# EAGLE design battery_watcher (EAGLE 9.3.2)
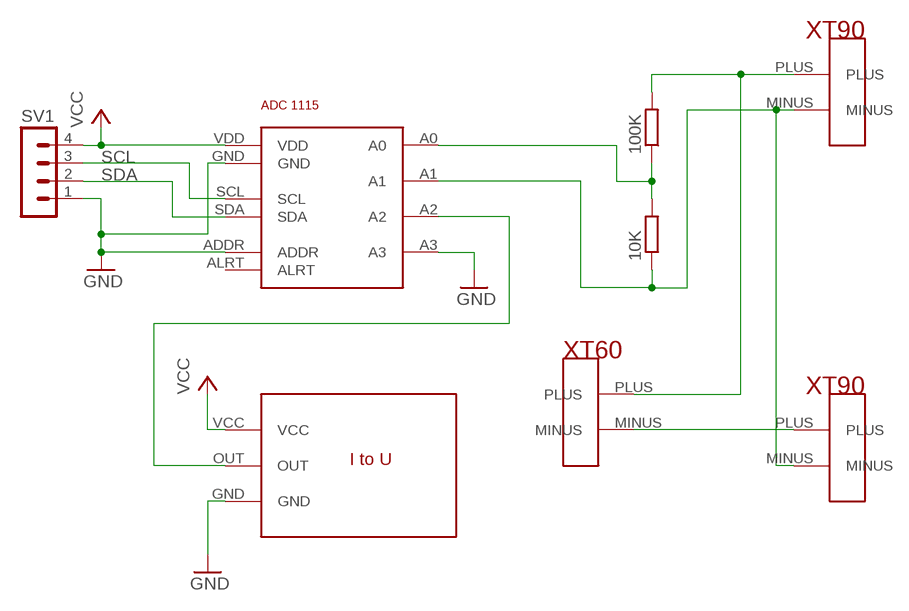
[diagram p0: schematic, sheet 1]

## Parts
10K  R-EU_M1206  [M1206]
100K  R-EU_M1206  [M1206]
SV1  MA04-1  [MA04-1]
U$1  ADC1115  [ADC1115]
U$2  I2U_MODULE  [I2U]
U$3  XT90  [XT90]
U$4  XT90  [XT90]
U$5  XT60  [XT60]

## Nets
GND: SV1.1 U$1.A3 U$1.ADDR U$1.GND U$2.GND
N$1: U$1.A2 U$2.OUT
N$2: 10K.2 100K.1 U$1.A0
N$3: 100K.2 U$4.PLUS U$5.PLUS
N$4: 10K.1 U$1.A1 U$3.MINUS U$4.MINUS
N$6: U$3.PLUS U$5.MINUS
SCL: SV1.3 U$1.SCL
SDA: SV1.2 U$1.SDA
VCC: SV1.4 U$1.VDD U$2.VCC
Unconnected: U$1.ALRT

## Library data of the parts
10K 100K = rcl:R-EU_: RESISTOR, European symbol; SPICEPREFIX: R
SV1 = con-lstb:MA04-1: PIN HEADER; OC_FARNELL: unknown; OC_NEWARK: unknown
U$1 = ligocki:ADC1115
U$2 = ligocki:I2U_MODULE
U$3 U$4 = ligocki:XT90
U$5 = ligocki:XT60

## Board
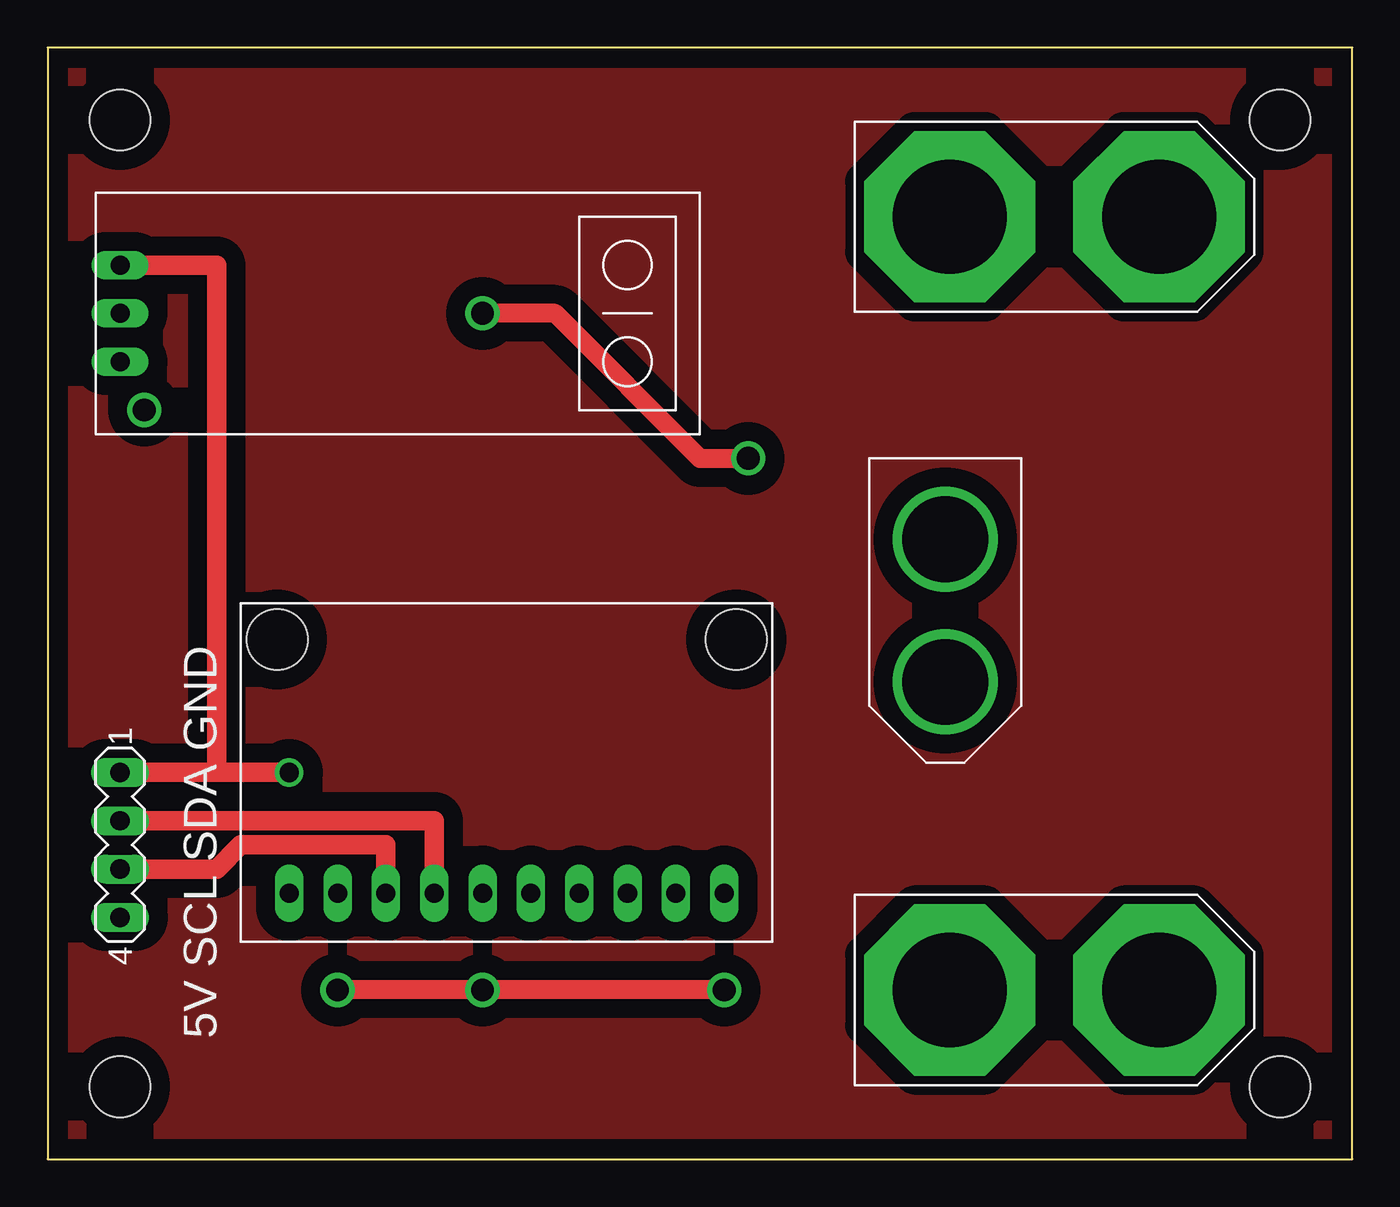
[diagram p1: board, top side]
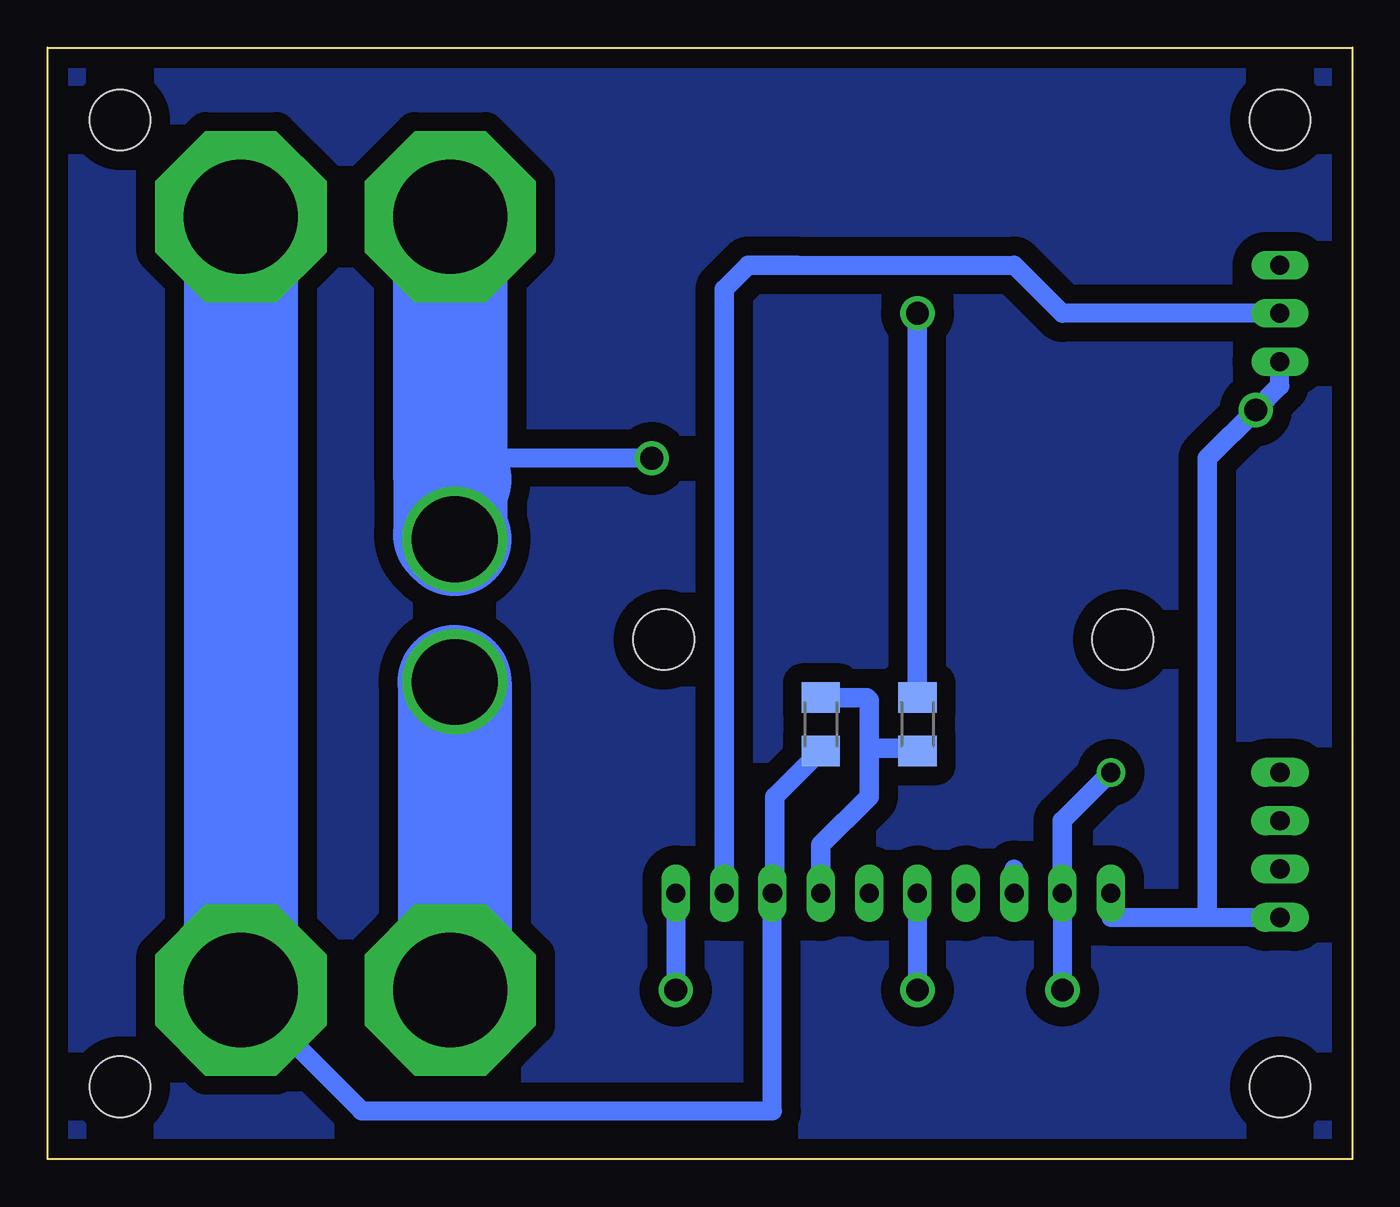
[diagram p2: board, bottom side, seen from below]

Size 68.58 x 58.42 mm. Coordinates in mm from the lower left corner, seen from the top.
Outline: 0,0 68.58,0 68.58,58.42 0,58.42 0,0
Copper layers (1*16): Top 0.035mm / dielectric 1.5mm / Bottom 0.035mm
Design rules "default": minimum track width 6mil, minimum drill 0.35mm, track to track 6mil, track to pad 6mil, pad to pad 6mil, via to via 6mil, smd to smd 6mil, copper to edge 40mil, drill to drill 6mil, minimum pad ring 10mil, minimum via ring 8mil, stop-mask expansion 4mil, vias tented up to drill 0mil, thermal gap 10mil
Holes 3.2 mm at 3.81,3.81 64.77,3.81 64.77,54.61 3.81,54.61

### Footprints (pad centres in the part's own frame; a part is rotated, then mirrored left to right if it is on the bottom)
M1206 = smd 1.6 x 2: 1 -1.4,0; 2 1.4,0
MA04-1 = drill 1.016 long: 1 -3.81,0; 2 -1.27,0; 3 1.27,0; 4 3.81,0
ADC1115 = drill 1 long: A0 17.78,2.54; A1 20.32,2.54; A2 22.86,2.54; A3 25.4,2.54; ADDR 12.7,2.54; ALRT 15.24,2.54; GND 5.08,2.54; SCL 7.62,2.54; SDA 10.16,2.54; VDD 2.54,2.54 | hole 3.2: 1.905,15.875; 26.035,15.875
I2U = drill 1 long: GND 3.81,1.27; OUT 6.35,1.27; VCC 8.89,1.27
XT90 = drill 6 pad 9 octagon: MINUS 0,0; PLUS 11,0
XT60 = drill 4.5 pad 5.5: MINUS 11.75,4; PLUS 4.25,4

### Placement (x,y rotation side)
10K  27.94,22.86 90 bottom
100K  22.86,22.86 90 bottom
SV1  3.81,16.51 270 top
U$1  10.16,11.43 0 top
U$2  2.54,50.8 270 top
U$3  58.42,8.89 180 top
U$4  58.42,49.53 180 top
U$5  43.18,36.83 270 top

### Tracks (layer width: path | path; a pad name or v marks a point on that pad's centre or on a via)
GND  (via drill 1, 1.2)
  Top 1: v35.56,8.89 v22.86,8.89 v15.24,8.89
  Top 1.016: SV1.1 8.89,20.32 | 8.89,20.32 v12.7,20.32 | U$2.GND 8.89,46.99 8.89,20.32
  Bottom 1: U$1.A3 v35.56,8.89 | U$1.GND v15.24,8.89 | U$1.ADDR v22.86,8.89
  Bottom 1.016: v12.7,20.32 15.24,17.78 U$1.GND
N$1
  Bottom 1: 29.21,46.99 17.78,46.99 15.24,44.45 U$2.OUT
  Bottom 1.016: U$1.A2 33.02,45.72 31.75,46.99 29.21,46.99
N$2
  Bottom 1.016: 100K.1 22.99,21.59 25.4,21.59 | 25.4,21.59 25.4,24.13 25.53,24.26 10K.2 | U$1.A0 27.94,16.51 25.4,19.05 25.4,21.59
N$3  (via drill 1.2)
  Top 1: v36.83,36.83 34.29,36.83 26.67,44.45 v22.86,44.45
  Bottom 1: v36.83,36.83 47.18,36.83 47.18,35.73
  Bottom 1.016: 100K.2 v22.86,44.45
  Bottom 6: 47.18,35.73 47.42,35.97 U$4.PLUS 47.42,32.82 U$5.PLUS
N$4
  Bottom 1: U$3.MINUS 52.07,2.54 30.48,2.54 U$1.A1 30.35,13.97
  Bottom 1.016: 10K.1 30.35,19.05 30.35,13.97
  Bottom 6: U$4.MINUS U$3.MINUS
N$5
  pour Top (isolate 1): 0,58.42 68.58,58.42 68.58,0 0,0
N$6
  Bottom 6: U$5.MINUS 47.18,9.13 U$3.PLUS
N$7
  pour Bottom (isolate 1): 0,58.42 68.58,58.42 68.58,0 0,0
SCL
  Top 1.016: SV1.3 8.89,15.24 10.16,16.51 17.78,16.51 U$1.SCL
  Bottom 1: U$1.SCL 17.78,15.24
SDA
  Top 1.016: SV1.2 20.32,17.78 U$1.SDA
VCC  (via drill 1.2)
  Bottom 1: v5.08,39.37 3.81,40.64 U$2.VCC | U$1.VDD 12.7,12.7 7.62,12.7 SV1.4
  Bottom 1.016: v5.08,39.37 7.62,36.83 7.62,12.7

### Text on the board
tPlace: 5V SCL SDA GND